# EAGLE schematic Projeto_SE v20 (EAGLE 9.7.0)
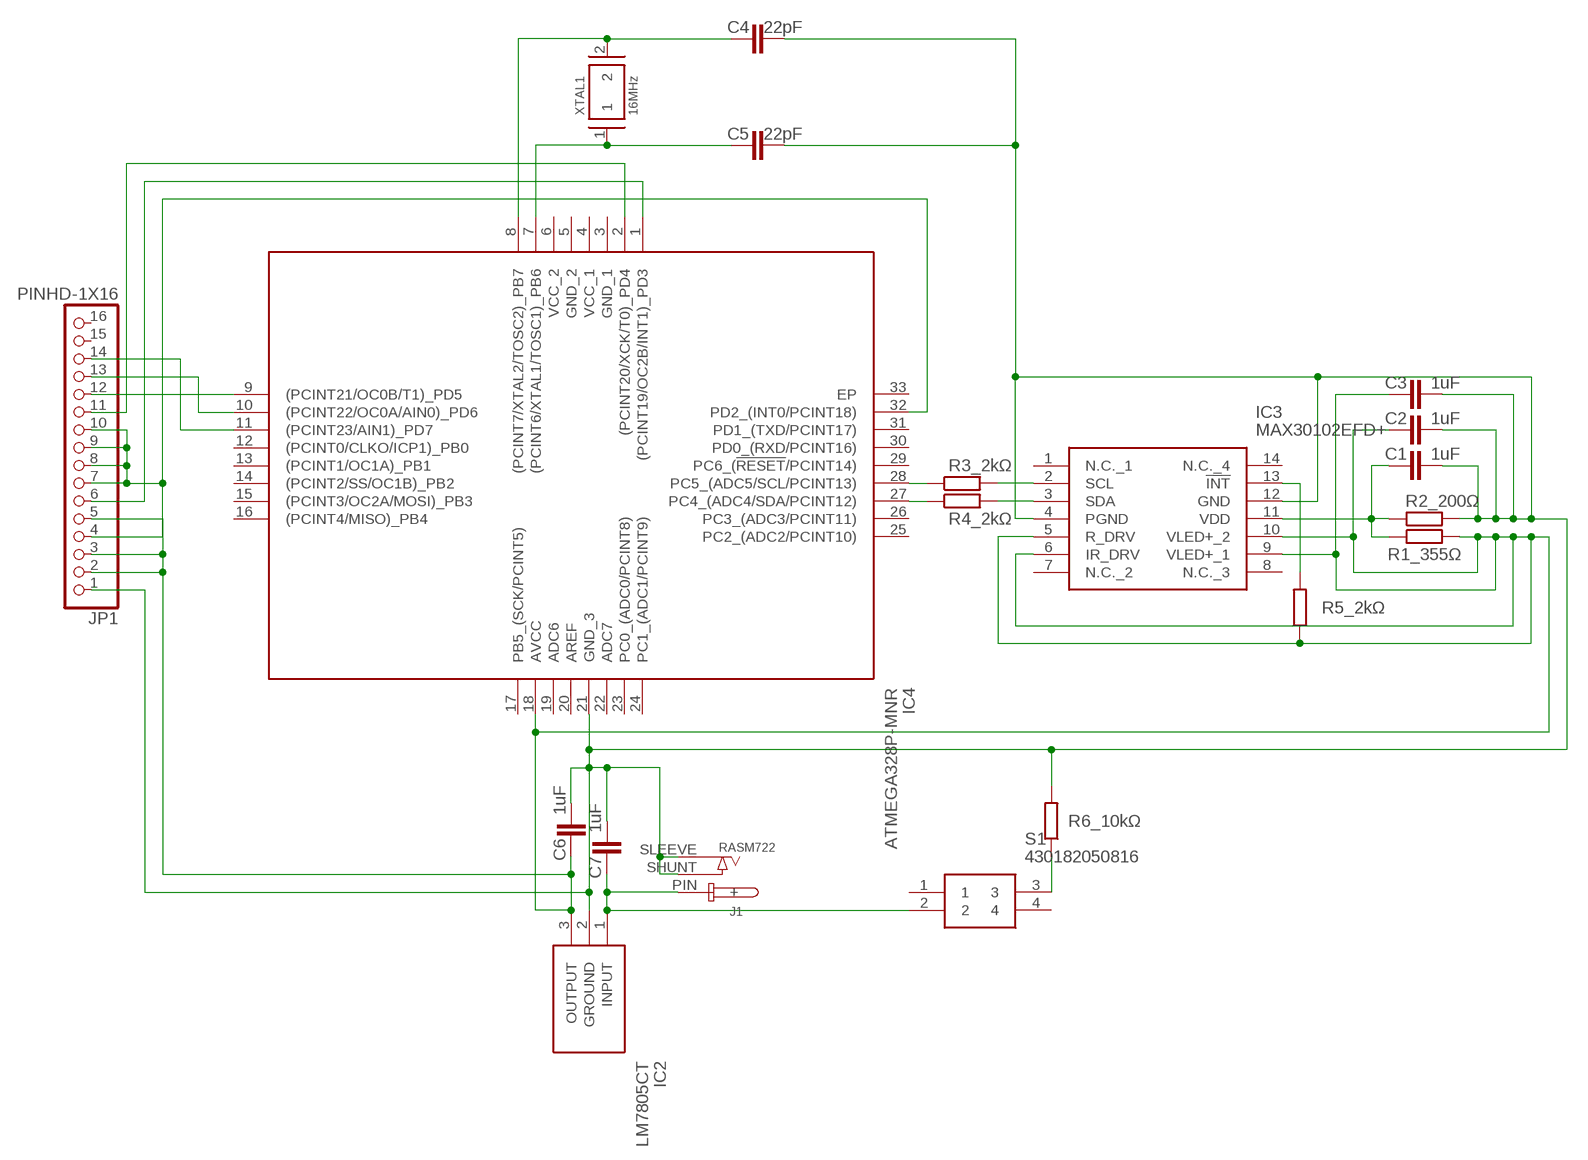
[diagram p0: schematic, sheet 1]

## Parts
C1  1uF  C_CHIP-0402(1005-METRIC)  [CAPC1005X60]
C2  1uF  C_CHIP-0402(1005-METRIC)  [CAPC1005X60]
C3  1uF  C_CHIP-0402(1005-METRIC)  [CAPC1005X60]
C4  22pF  C_CHIP-0402(1005-METRIC)  [CAPC1005X60]
C5  22pF  C_CHIP-0402(1005-METRIC)  [CAPC1005X60]
C6  1uF  C_CHIP-0402(1005-METRIC)  [CAPC1005X60]
C7  1uF  C_CHIP-0402(1005-METRIC)  [CAPC1005X60]
IC2  LM7805CT  [TO254P470X1028X1955-3P]
IC3  MAX30102EFD+  [14-LEAD-OESIP]
IC4  ATMEGA328P-MNR  [QFN50P500X500X100-33N]
J1  RASM722  [RASM722X]
JP1  PINHD-1X16  [1X16]
R1  R1_355Ω  R_CHIP-2512(6332-METRIC)  [RESC6332X71]
R2  R2_200Ω  R_CHIP-2512(6332-METRIC)  [RESC6332X71]
R3  R3_2kΩ  R_CHIP-2512(6332-METRIC)  [RESC6332X71]
R4  R4_2kΩ  R_CHIP-2512(6332-METRIC)  [RESC6332X71]
R5  R5_2kΩ  R_CHIP-2512(6332-METRIC)  [RESC6332X71]
R6  R6_10kΩ  R_CHIP-2512(6332-METRIC)  [RESC6332X71]
S1  430182050816  [430182070816]
XTAL1  16MHz  FC4SDFREQUENCY_16MHZ  [XTAL1170X500X450N]

## Nets
5V: C2.1 C3.1 C6.1 IC2.3(OUTPUT) IC3.5(R_DRV) IC3.6(IR_DRV) IC3.9(VLED+_1) IC3.10(VLED+_2) IC4.18(AVCC) JP1.2 JP1.3 JP1.5 R1.2 R5.1
GND: C1.2 C2.2 C3.2 C4.2 C5.2 C6.2 C7.2 IC2.2(GROUND) IC3.4(PGND) IC3.12(GND) IC4.21(GND_3) J1.SHUNT(-) J1.SLEEVE(NEG) JP1.1 R2.2 R6.2
N$1: C1.1 IC3.11(VDD) R1.1 R2.1
N$2: C4.1 IC4.8((PCINT7/XTAL2/TOSC2)_PB7) XTAL1.2
N$3: C5.1 IC4.7((PCINT6/XTAL1/TOSC1)_PB6) XTAL1.1
N$4: IC3.2(SCL) R3.2
N$6: IC3.3(SDA) R4.2
N$7: R6.1 S1.3
N$8: IC3.13(!INT) R5.2
N$9: C7.1 IC2.1(INPUT) J1.PIN(+) S1.2
N$10: IC4.1((PCINT19/OC2B/INT1)_PD3) JP1.6
N$11: IC4.2((PCINT20/XCK/T0)_PD4) JP1.11
N$12: IC4.9((PCINT21/OC0B/T1)_PD5) JP1.12
N$13: IC4.10((PCINT22/OC0A/AIN0)_PD6) JP1.13
N$14: IC4.11((PCINT23/AIN1)_PD7) JP1.14
N$15: IC4.32(PD2_(INT0/PCINT18)) JP1.4 JP1.7 JP1.8 JP1.9 JP1.10
SCL: IC4.28(PC5_(ADC5/SCL/PCINT13)) R3.1
SDA: IC4.27(PC4_(ADC4/SDA/PCINT12)) R4.1
Unconnected: IC3.1(N.C._1) IC3.7(N.C._2) IC3.8(N.C._3) IC3.14(N.C._4) IC4.3(GND_1) IC4.4(VCC_1) IC4.5(GND_2) IC4.6(VCC_2) IC4.12((PCINT0/CLKO/ICP1)_PB0) IC4.13((PCINT1/OC1A)_PB1) IC4.14((PCINT2/SS/OC1B)_PB2) IC4.15((PCINT3/OC2A/MOSI)_PB3) IC4.16((PCINT4/MISO)_PB4) IC4.17(PB5_(SCK/PCINT5)) IC4.19(ADC6) IC4.20(AREF) IC4.22(ADC7) IC4.23(PC0_(ADC0/PCINT8)) IC4.24(PC1_(ADC1/PCINT9)) IC4.25(PC2_(ADC2/PCINT10)) IC4.26(PC3_(ADC3/PCINT11)) IC4.29(PC6_(!RESET!/PCINT14)) IC4.30(PD0_(RXD/PCINT16)) IC4.31(PD1_(TXD/PCINT17)) IC4.33(EP) JP1.15 JP1.16 S1.1 S1.4

## Library data of the parts
C1-C7 = Capacitor:C: Capacitor - Generic; CATEGORY: Capacitor
IC2 = LM7805CT:LM7805CT: Linear voltage regulator,LM7805CT 5V 1A Source: Datasheet <http://www.ti.com/lit/ds/symlink/lm340.pdf>; ARROW_PART_NUMBER: LM7805CT; ARROW_PRICE-STOCK: https://www.arrow.com/en/products/lm7805ct/texas-instruments; DESCRIPTION: Linear voltage regulator,LM7805CT 5V 1A; HEIGHT: 4.7mm; MANUFACTURER_NAME: Texas Instruments; MANUFACTURER_PART_NUMBER: LM7805CT; MOUSER_PART_NUMBER: 926-LM7805CT; MOUSER_PRICE-STOCK: https://www.mouser.co.uk/ProductDetail/Texas-Instruments/LM7805CT?qs=QbsRYf82W3EaqXeMDVwIfQ%3D%3D
IC3 = MAX30102EFD:MAX30102EFD+: MAXIM INTEGRATED PRODUCTS - MAX30102EFD+ - PULSE OXIMETER/HEART RATE SENSOR, OESIP Source: Datasheet <https://datasheets.maximintegrated.com/en/ds/MAX30102.pdf>; DESCRIPTION: MAXIM INTEGRATED PRODUCTS - MAX30102EFD+ - PULSE OXIMETER/HEART RATE SENSOR, OESIP; HEIGHT: mm; MANUFACTURER_NAME: Maxim Integrated; MANUFACTURER_PART_NUMBER: MAX30102EFD+; MOUSER_PART_NUMBER: 700-MAX30102EFD+; MOUSER_PRICE-STOCK: https://www.mouser.co.uk/ProductDetail/Maxim-Integrated/MAX30102EFD%2b?qs=nVS1qgv%252BQrk9UYEvS27V%2Fg%3D%3D
IC4 = ATMEGA328P:ATMEGA328P-MNR: 8-bit Microcontrollers - MCU AVR 32K FLSH 2K SRAM 1KB EE-20 MHZ 105C Source: Datasheet <http://ww1.microchip.com/downloads/en/DeviceDoc/ATmega48A-PA-88A-PA-168A-PA-328-P-DS-DS40002061A.pdf>; ARROW_PART_NUMBER: ATMEGA328P-MNR; ARROW_PRICE-STOCK: https://www.arrow.com/en/products/atmega328p-mnr/microchip-technology?region=nac; DESCRIPTION: 8-bit Microcontrollers - MCU AVR 32K FLSH 2K SRAM 1KB EE-20 MHZ 105C; HEIGHT: 1mm; MANUFACTURER_NAME: Microchip; MANUFACTURER_PART_NUMBER: ATMEGA328P-MNR; MOUSER_PART_NUMBER: 556-ATMEGA328P-MNR; MOUSER_PRICE-STOCK: https://www.mouser.co.uk/ProductDetail/Microchip-Technology-Atmel/ATMEGA328P-MNR?qs=6Dg1WZIWLC5fsr6lNbxG3A%3D%3D
J1 = Connector:RASM722: CONN PWR JACK 2.1X5.5MM SOLDER Manufacturer's datasheet <http://www.switchcraft.com/Documents/EDG4.pdf#page=135>; CREATED_BY: PCBLayout.com; DIGI-KEY_PART_NO: RASM722X-ND; MANUFACTURER: Switchcraft Inc.; MPN: RASM722X
JP1 = Connector:PINHD-1X16: PIN HEADER; CATEGORY: CONNECTOR; SUB-CATEGORY: PIN-HEADER
R1-R6 = Resistor:R: Resistor Fixed - Generic; CATEGORY: Resistor; SUB-CATEGORY: Fixed
S1 = button:430182050816: Black Tactile Tactile Switch, NO 50 mA 1.6mm Surface Mount Source: Datasheet <http://katalog.we-online.de/em/datasheet/4301x2xxx8x6.pdf>; DESCRIPTION: Black Tactile Tactile Switch, NO 50 mA 1.6mm Surface Mount; HEIGHT: mm; MANUFACTURER_NAME: Wurth Elektronik; MANUFACTURER_PART_NUMBER: 430182050816; MOUSER_PART_NUMBER: 710-430182050816; MOUSER_PRICE-STOCK: https://www.mouser.co.uk/ProductDetail/Wurth-Elektronik/430182050816?qs=wr8lucFkNMUyle0jQPgWGw%3D%3D
XTAL1 = Frequency-Source:FC4SD: CRYSTAL 8.0000MHZ 20PF SMD 8MHz ±30ppm Crystal 20pF 80 Ohms HC-49/US Datasheet <https://www.foxonline.com/pdfs/C4SD.pdf>; CATEGORY: Resistance Weld; DESCRIPTION: SMD Crystal; FREQUENCY: 16MHZ; MANUFRACTURER: Fox Electronics; MPN: FC4SDCBMF16.0-T1; OPERATING_TEMPERATURE: -20*C to 70*c; PART_STATUS: Active; ROHS_COMPLIANT: COMPLIANT; SERIES: C4SD; SUB_CATEGORY: Resistance Weld SMD Crystal; TOLERANCE: ±30ppm; TYPE: Crystal